# EAGLE schematic DAC (EAGLE 9.5.1)

## Sheet 1 of 6
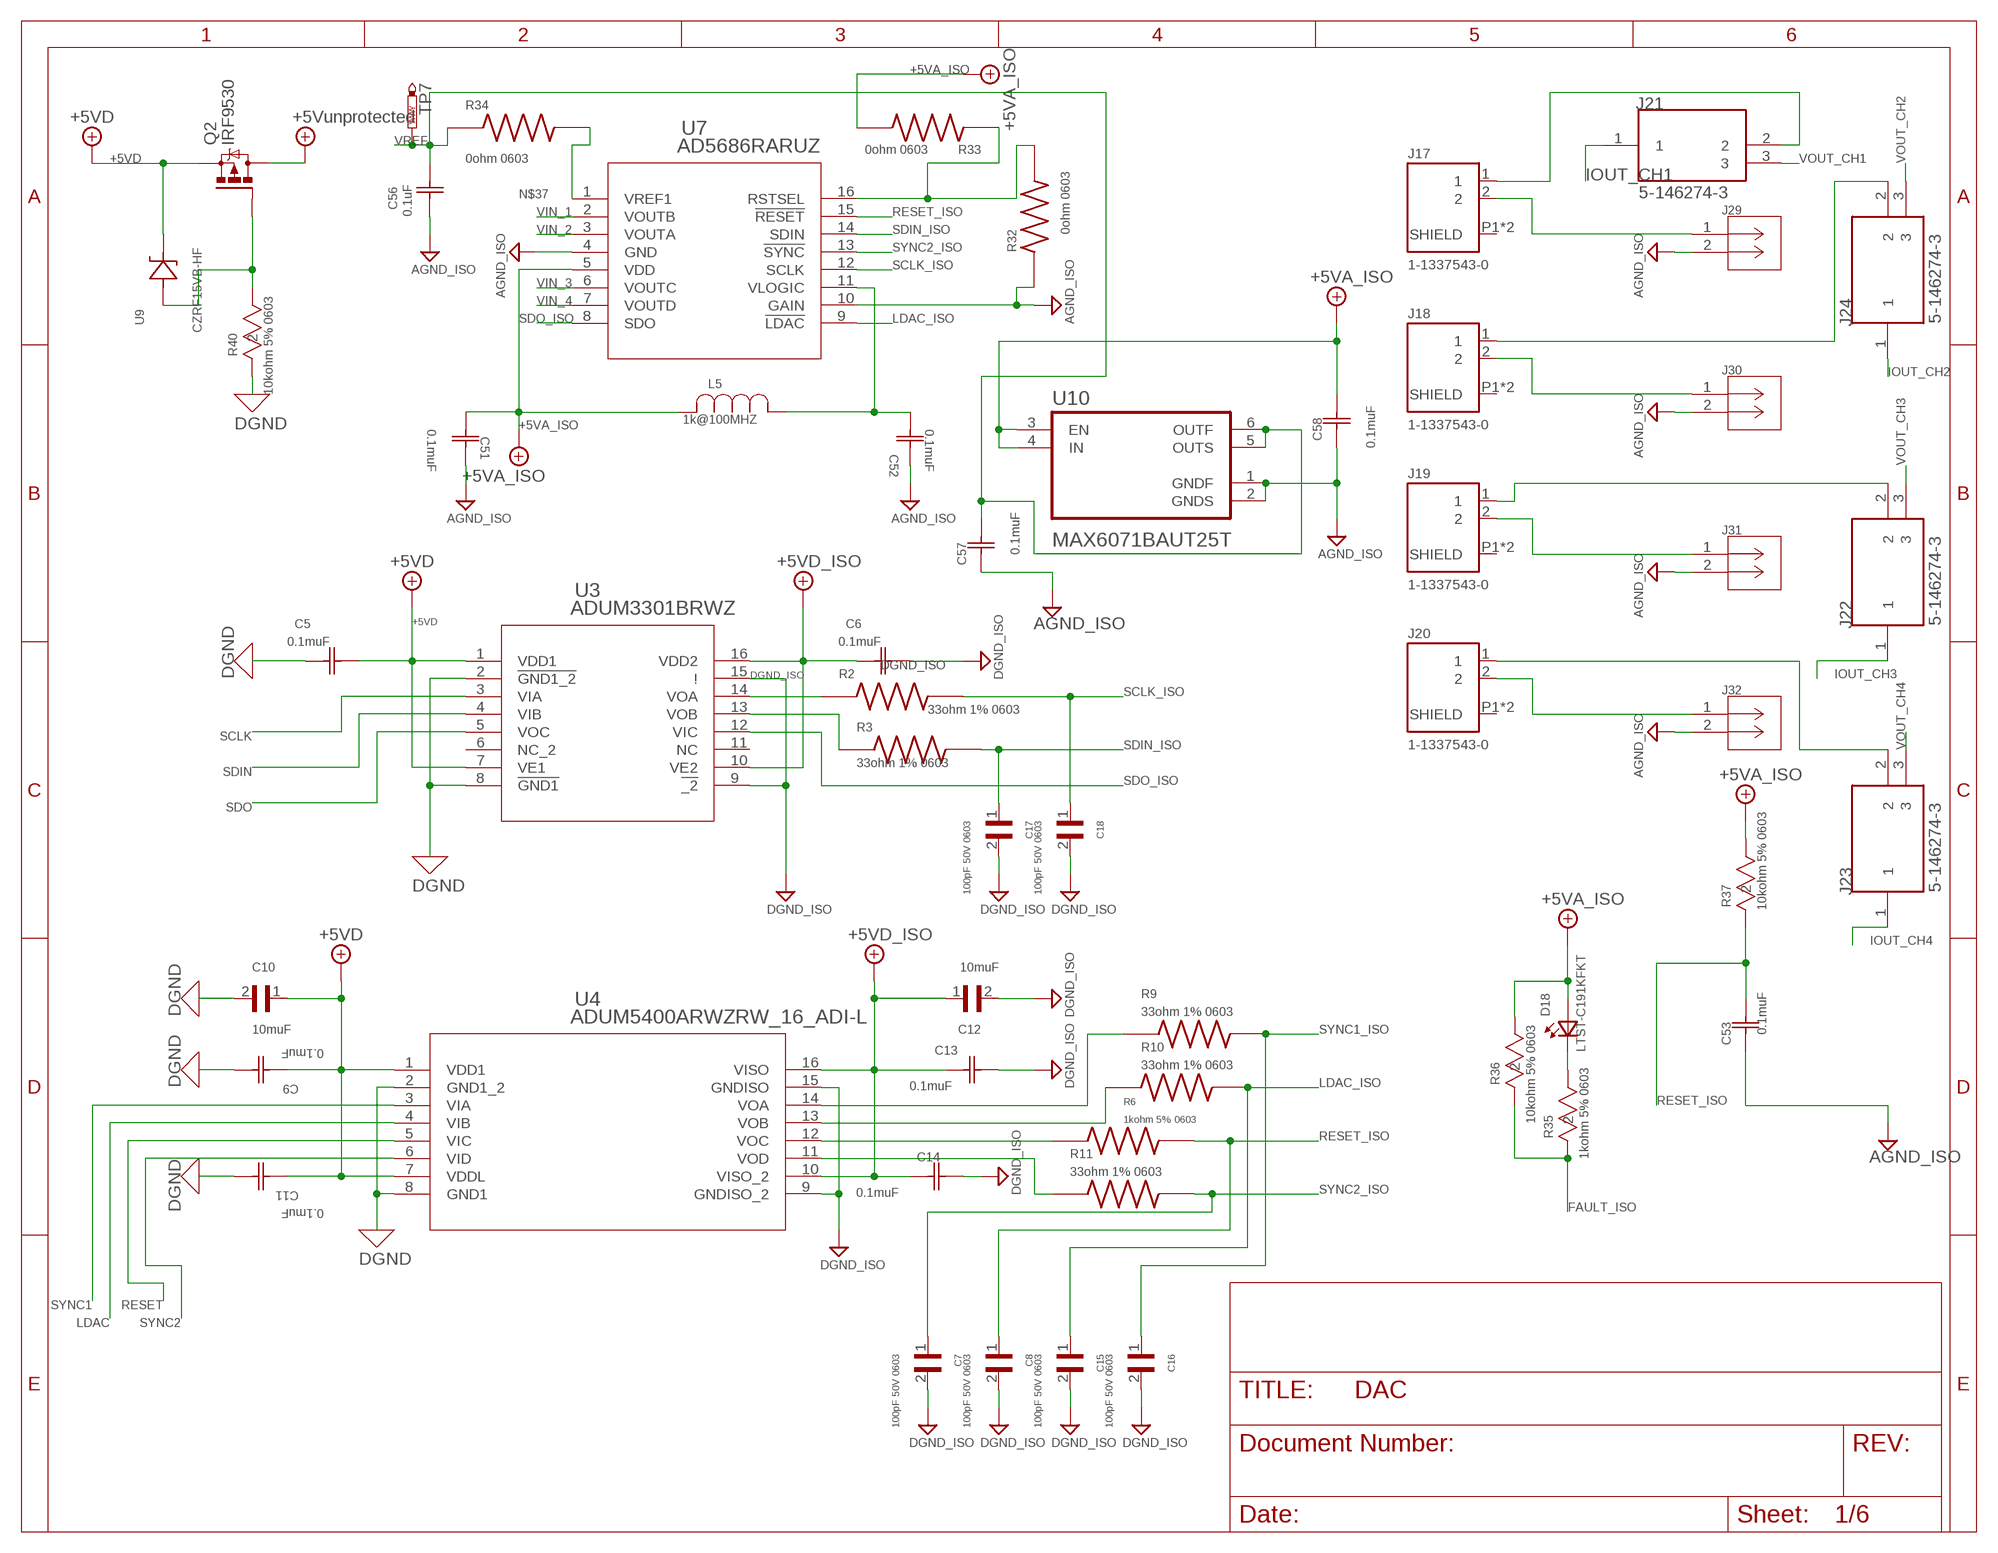
[diagram p0: schematic, sheet 1]

### Parts
C5  0.1muF  GRM188R71E104KA01D  [G-188_MUR]
C6  0.1muF  GRM188R71E104KA01D  [G-188_MUR]
C7  100pF 50V 0603  06035A101JAT2A  [CAPC1608X90N]
C8  100pF 50V 0603  06035A101JAT2A  [CAPC1608X90N]
C9  0.1muF  GRM188R71E104KA01D  [G-188_MUR]
C10  10muF  GRM21BR61A106KE14L  [CAPC2012X135N]
C11  0.1muF  GRM188R71E104KA01D  [G-188_MUR]
C12  10muF  GRM21BR61A106KE14L  [CAPC2012X135N]
C13  0.1muF  GRM188R71E104KA01D  [G-188_MUR]
C14  0.1muF  GRM188R71E104KA01D  [G-188_MUR]
C15  100pF 50V 0603  06035A101JAT2A  [CAPC1608X90N]
C16  100pF 50V 0603  06035A101JAT2A  [CAPC1608X90N]
C17  100pF 50V 0603  06035A101JAT2A  [CAPC1608X90N]
C18  100pF 50V 0603  06035A101JAT2A  [CAPC1608X90N]
C51  0.1muF  GRM188R71E104KA01D  [G-188_MUR]
C52  0.1muF  GRM188R71E104KA01D  [G-188_MUR]
C53  0.1muF  GRM188R71E104KA01D  [G-188_MUR]
C56  0.1muF  GRM188R71E104KA01D  [G-188_MUR]
C57  0.1muF  GRM188R71E104KA01D  [G-188_MUR]
C58  0.1muF  GRM188R71E104KA01D  [G-188_MUR]
D18  LTST-C191KFKT  [0603]
J17  1-1337543-0  [CONN_1-1337543-0]
J18  1-1337543-0  [CONN_1-1337543-0]
J19  1-1337543-0  [CONN_1-1337543-0]
J20  1-1337543-0  [CONN_1-1337543-0]
J21  5-146274-3  [TE_5-146274-3]
J22  5-146274-3  [TE_5-146274-3]
J23  5-146274-3  [TE_5-146274-3]
J24  5-146274-3  [TE_5-146274-3]
J29  61300211121  [CONN_61300211121_WRE]
J30  61300211121  [CONN_61300211121_WRE]
J31  61300211121  [CONN_61300211121_WRE]
J32  61300211121  [CONN_61300211121_WRE]
L5  1k@100MHZ  BLM18AG601SN1D  [IND_BLM18_0603_MUR]
Q2  IRF9530  [TO220BV]
R2  33ohm 1% 0603  CRCW060333R0FKEA  [RESC1508X50N]
R3  33ohm 1% 0603  CRCW060333R0FKEA  [RESC1508X50N]
R6  1kohm 5% 0603  ERJ-3GEYJ102V  [RESC1608X55N]
R9  33ohm 1% 0603  CRCW060333R0FKEA  [RESC1508X50N]
R10  33ohm 1% 0603  CRCW060333R0FKEA  [RESC1508X50N]
R11  33ohm 1% 0603  CRCW060333R0FKEA  [RESC1508X50N]
R32  0ohm 0603  CRCW06030000Z0EBC  [RESC1608X55N]
R33  0ohm 0603  CRCW06030000Z0EBC  [RESC1608X55N]
R34  0ohm 0603  CRCW06030000Z0EBC  [RESC1608X55N]
R35  1kohm 5% 0603  ERA-3AEB153V  [RC0603N_PAN]
R36  10kohm 5% 0603  ERA-3AEB153V  [RC0603N_PAN]
R37  10kohm 5% 0603  ERA-3AEB153V  [RC0603N_PAN]
R40  10kohm 5% 0603  ERA-3AEB153V  [RC0603N_PAN]
TP7  PTR1B1,27  [B1,27]
U3  ADUM3301BRWZ  [RW_16_ADI]
U4  ADUM5400ARWZRW_16_ADI-L  [RW_16_ADI-L]
U7  AD5686RARUZ  [RU-16_ADI]
U9  CZRF15VB-HF  [CZRF]
U10  MAX6071BAUT25T  [SOT95P280X145-6N]

### Nets
+5V_UN: Q2.D ; supply symbol labelled +5Vunprotected
+5VA_ISO: C51.1 C58.2 D18.2(A2) L5.2 R33.2 R36.1 R37.1 U7.5(VDD) U10.3(EN) U10.4(IN) ; also sheet 2,3,4,5
+5VD: C5.2 C9.1 C10.1 C11.1 Q2.S U3.1(VDD1) U3.7(VE1) U4.1(VDD1) U4.7(VDDL) U9.1 ; also sheet 2
+5VD_ISO: C6.1 C12.1 C13.1 C14.1 U3.10(VE2) U3.16(VDD2) U4.10(VISO_2) U4.16(VISO) ; also sheet 3
AGND_ISO: C51.2 C52.2 C53.1 C56.1 C57.1 C58.1 J29.2 J30.2 J31.2 J32.2 R32.1 U7.4(GND) U7.10(GAIN) U10.1(GNDF) U10.2(GNDS) ; also sheet 2,3,4,5
DGND: C5.1 C9.2 C10.2 C11.2 R40.2 U3.2(!GND1_2) U3.8(!GND1) U4.2(GND1_2) U4.8(GND1) ; also sheet 2
DGND_ISO: C6.2 C7.2 C8.2 C12.2 C13.2 C14.2 C15.2 C16.2 C17.2 C18.2 U3.9(!_2) U3.15(!) U4.9(GNDISO_2) U4.15(GNDISO) ; also sheet 3
FAULT_ISO: R35.2 R36.2 ; also sheet 2,3,4,5
IOUT_CH1: J21.1 ; also sheet 3
IOUT_CH2: J24.1 ; also sheet 4
IOUT_CH3: J22.1 ; also sheet 5
IOUT_CH4: J23.1 ; also sheet 2
LDAC: U4.4(VIB) ; also sheet 2
LDAC_ISO: C15.1 R10.2 U7.9(!LDAC)
N$5: C52.1 L5.1 U7.11(VLOGIC)
N$7: R9.1 U4.14(VOA)
N$8: R2.1 U3.14(VOA)
N$9: R3.1 U3.13(VOB)
N$10: R10.1 U4.13(VOB)
N$11: R6.1 U4.12(VOC)
N$12: R11.1 U4.11(VOD)
N$31: J17.2 J29.1
N$35: D18.1(K2) R35.1
N$36: J18.2 J30.1
N$37: R34.2 U7.1(VREF1)
N$38: J17.1 J21.2
N$41: J18.1 J24.2
N$43: J19.2 J31.1
N$44: J19.1 J22.2
N$45: J20.1 J23.2
N$55: J20.2 J32.1
N$80: Q2.G R40.1 U9.2
N$89: R32.2 R33.1 U7.16(RSTSEL)
RESET: U4.5(VIC) ; also sheet 2
RESET_ISO: C8.1 C53.2 R6.2 R37.2 U7.15(!RESET) ; also sheet 2,3,4,5
SCLK: U3.3(VIA) ; also sheet 2
SCLK_ISO: C18.1 R2.2 U7.12(SCLK) ; also sheet 2,3,4,5
SDIN: U3.4(VIB) ; also sheet 2
SDIN_ISO: C17.1 R3.2 U7.14(SDIN) ; also sheet 2,3,4,5
SDO: U3.5(VOC) ; also sheet 2
SDO_ISO: U3.12(VIC) U7.8(SDO) ; also sheet 2,3,4,5
SYNC1: U4.3(VIA) ; also sheet 2
SYNC1_ISO: C16.1 R9.2 ; also sheet 2,3,4,5
SYNC2: U4.6(VID) ; also sheet 2
SYNC2_ISO: C7.1 R11.2 U7.13(!SYNC)
VIN_1: U7.2(VOUTB) ; also sheet 3
VIN_2: U7.3(VOUTA) ; also sheet 4
VIN_3: U7.6(VOUTC) ; also sheet 5
VIN_4: U7.7(VOUTD) ; also sheet 2
VOUT_CH1: J21.3 ; also sheet 3
VOUT_CH2: J24.3 ; also sheet 4
VOUT_CH3: J22.3 ; also sheet 5
VOUT_CH4: J23.3 ; also sheet 2
VREF: C56.2 C57.2 R34.1 TP7.TP U10.5(OUTS) U10.6(OUTF) ; also sheet 2,3,4,5
Unconnected: J17.P1(SHIELD) J17.P2(SHIELD) J18.P1(SHIELD) J18.P2(SHIELD) J19.P1(SHIELD) J19.P2(SHIELD) J20.P1(SHIELD) J20.P2(SHIELD) U3.6(NC_2) U3.11(NC)

### Notes on the sheet
- 0.1uF

## Sheet 2 of 6
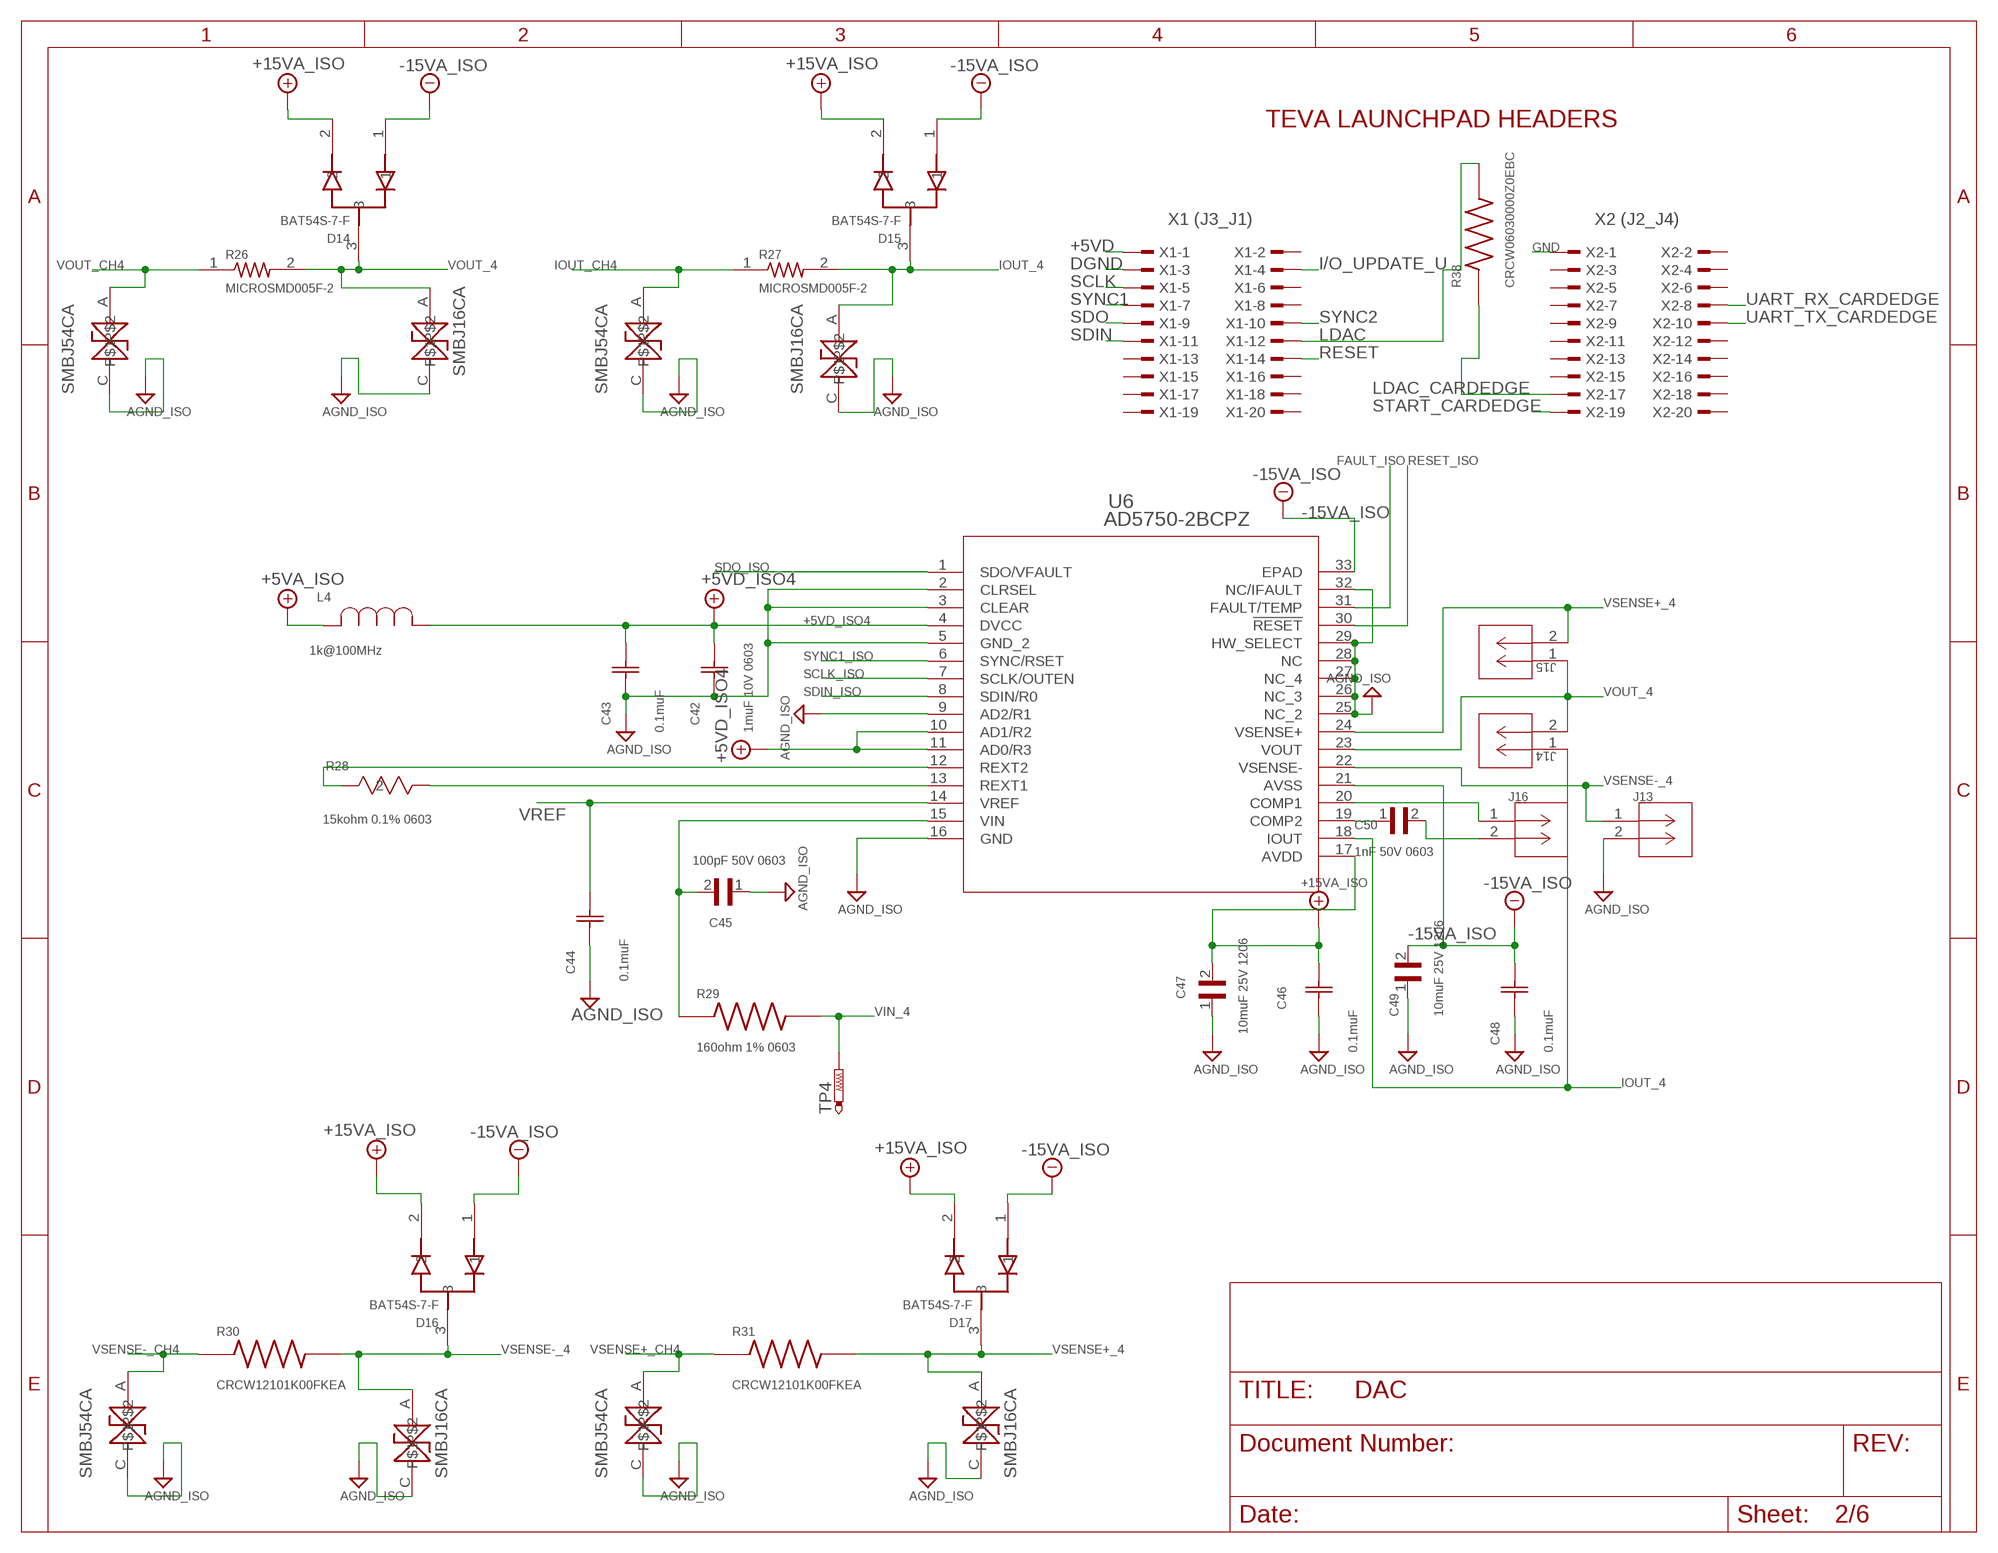
[diagram p1: schematic, sheet 2]

### Parts
C42  1muF 10V 0603  C0603C105K4PALTU  [CAPC17595_90N_KEM]
C43  0.1muF  GRM188R71E104KA01D  [G-188_MUR]
C44  0.1muF  GRM188R71E104KA01D  [G-188_MUR]
C45  100pF 50V 0603  06035A101JAT2A  [CAPC1608X90N]
C46  0.1muF  GRM188R71E104KA01D  [G-188_MUR]
C47  10muF 25V 1206  C1206C106Z3VAC7800  [CAPC3216X180N]
C48  0.1muF  GRM188R71E104KA01D  [G-188_MUR]
C49  10muF 25V 1206  C1206C106Z3VAC7800  [CAPC3216X180N]
C50  1nF 50V 0603  GRM1885C1H102JA01D  [CAPC1608X90N]
D14  BAT54S-7-F  [SOT95P240X110-3N]
D15  BAT54S-7-F  [SOT95P240X110-3N]
D16  BAT54S-7-F  [SOT95P240X110-3N]
D17  BAT54S-7-F  [SOT95P240X110-3N]
J13  61300211121  [CONN_61300211121_WRE]
J14  61300211121  [CONN_61300211121_WRE]
J15  61300211121  [CONN_61300211121_WRE]
J16  61300211121  [CONN_61300211121_WRE]
L4  1k@100MHz  BLM18AG601SN1D  [IND_BLM18_0603_MUR]
R26  MICROSMD005F-2  [RESC3125X65N]
R27  MICROSMD005F-2  [RESC3125X65N]
R28  15kohm 0.1% 0603  ERA-3AEB153V  [RC0603N_PAN]
R29  160ohm 1% 0603  ERJ-3GEYJ102V  [RESC1608X55N]
R30  CRCW12101K00FKEA  [RESC3225X60N]
R31  CRCW12101K00FKEA  [RESC3225X60N]
R38  CRCW06030000Z0EBC  [RESC1608X55N]
TP4  PTR1B1,27  [B1,27]
TV1  54_SMBJ54CA  [DIOM5436X220N]
TV2  54_SMBJ54CA  [DIOM5436X220N]
TV3  SMBJ54CA  54_SMBJ54CA  [DIOM5436X220N]
TV4  54_SMBJ54CA  [DIOM5436X220N]
TV17  SMBJ16CA  [DIOM5436X220N]
TV18  SMBJ16CA  [DIOM5436X220N]
TV19  SMBJ16CA  [DIOM5436X220N]
TV20  SMBJ16CA  [DIOM5436X220N]
U6  AD5750-2BCPZ  [CP_32_7_ADI]
X1  X1 (J3_J1)  TSW-110-07-G-D  [TSW-110-XX-G-D]
X2  X2 (J2_J4)  TSW-110-07-G-D  [TSW-110-XX-G-D]

### Nets
+5VA_ISO: L4.2 ; also sheet 1,3,4,5
+5VD: X1.1 ; also sheet 1
+5VD_ISO4: C42.2 C43.2 L4.1 U6.4(DVCC) U6.10(AD1/R2) U6.11(AD0/R3)
+15VA_ISO: C46.2 C47.2 D14.2 D15.2 D16.2 D17.2 U6.17(AVDD) ; also sheet 3,4,5
-15VA_ISO: C48.2 C49.2 D14.1 D15.1 D16.1 D17.1 U6.21(AVSS) U6.33(EPAD) ; also sheet 3,4,5
AGND_ISO: C42.1 C43.1 C44.1 C45.1 C46.1 C47.1 C48.1 C49.1 J13.2 TV1.C TV2.C TV3.C TV4.C TV17.C TV18.C TV19.C TV20.C U6.2(CLRSEL) U6.3(CLEAR) U6.5(GND_2) U6.9(AD2/R1) U6.16(GND) U6.25(NC_2) U6.26(NC_3) U6.27(NC_4) U6.28(NC) U6.29(HW_SELECT) U6.32(NC/IFAULT) ; also sheet 1,3,4,5
DGND: X1.3 ; also sheet 1
FAULT_ISO: U6.31(FAULT/TEMP) ; also sheet 1,3,4,5
GND: X2.1
I/O_UPDATE_U: X1.4
IOUT_4: D15.3 J14.1 R27.2 TV18.A U6.18(IOUT)
IOUT_CH4: R27.1 TV2.A ; also sheet 1
LDAC: R38.2 X1.12 ; also sheet 1
LDAC_CARDEDGE: R38.1 X2.17
N$4: R28.2 U6.12(REXT2)
N$22: R28.1 U6.13(REXT1)
N$27: C45.2 R29.1 U6.15(VIN)
N$28: C50.1 U6.19(COMP2)
N$29: J16.1 U6.20(COMP1)
N$30: C50.2 J16.2
RESET: X1.14 ; also sheet 1
RESET_ISO: U6.30(!RESET) ; also sheet 1,3,4,5
SCLK: X1.5 ; also sheet 1
SCLK_ISO: U6.7(SCLK/OUTEN) ; also sheet 1,3,4,5
SDIN: X1.11 ; also sheet 1
SDIN_ISO: U6.8(SDIN/R0) ; also sheet 1,3,4,5
SDO: X1.9 ; also sheet 1
SDO_ISO: U6.1(SDO/VFAULT) ; also sheet 1,3,4,5
START_CARDEDGE: X2.19
SYNC1: X1.7 ; also sheet 1
SYNC1_ISO: U6.6(SYNC/RSET) ; also sheet 1,3,4,5
SYNC2: X1.10 ; also sheet 1
UART_RX_CARDEDGE: X2.8
UART_TX_CARDEDGE: X2.10
VIN_4: R29.2 TP4.TP ; also sheet 1
VOUT_4: D14.3 J14.2 J15.1 R26.2 TV17.A U6.23(VOUT)
VOUT_CH4: R26.1 TV1.A ; also sheet 1
VREF: C44.2 U6.14(VREF) ; also sheet 1,3,4,5
VSENSE+_4: D17.3 J15.2 R31.2 TV20.A U6.24(VSENSE+)
VSENSE+_CH4: R31.1 TV4.A
VSENSE-_4: D16.3 J13.1 R30.2 TV19.A U6.22(VSENSE-)
VSENSE-_CH4: R30.1 TV3.A
Unconnected: X1.2 X1.6 X1.8 X1.13 X1.15 X1.16 X1.17 X1.18 X1.19 X1.20 X2.2 X2.3 X2.4 X2.5 X2.6 X2.7 X2.9 X2.11 X2.12 X2.13 X2.14 X2.15 X2.16 X2.18 X2.20

### Notes on the sheet
- TEVA LAUNCHPAD HEADERS
- SMBJ16CA
- SMBJ54CA | SMBJ54CA | SMBJ16CA
- SMBJ54CA | SMBJ16CA | SMBJ54CA | SMBJ16CA

## Sheet 3 of 6
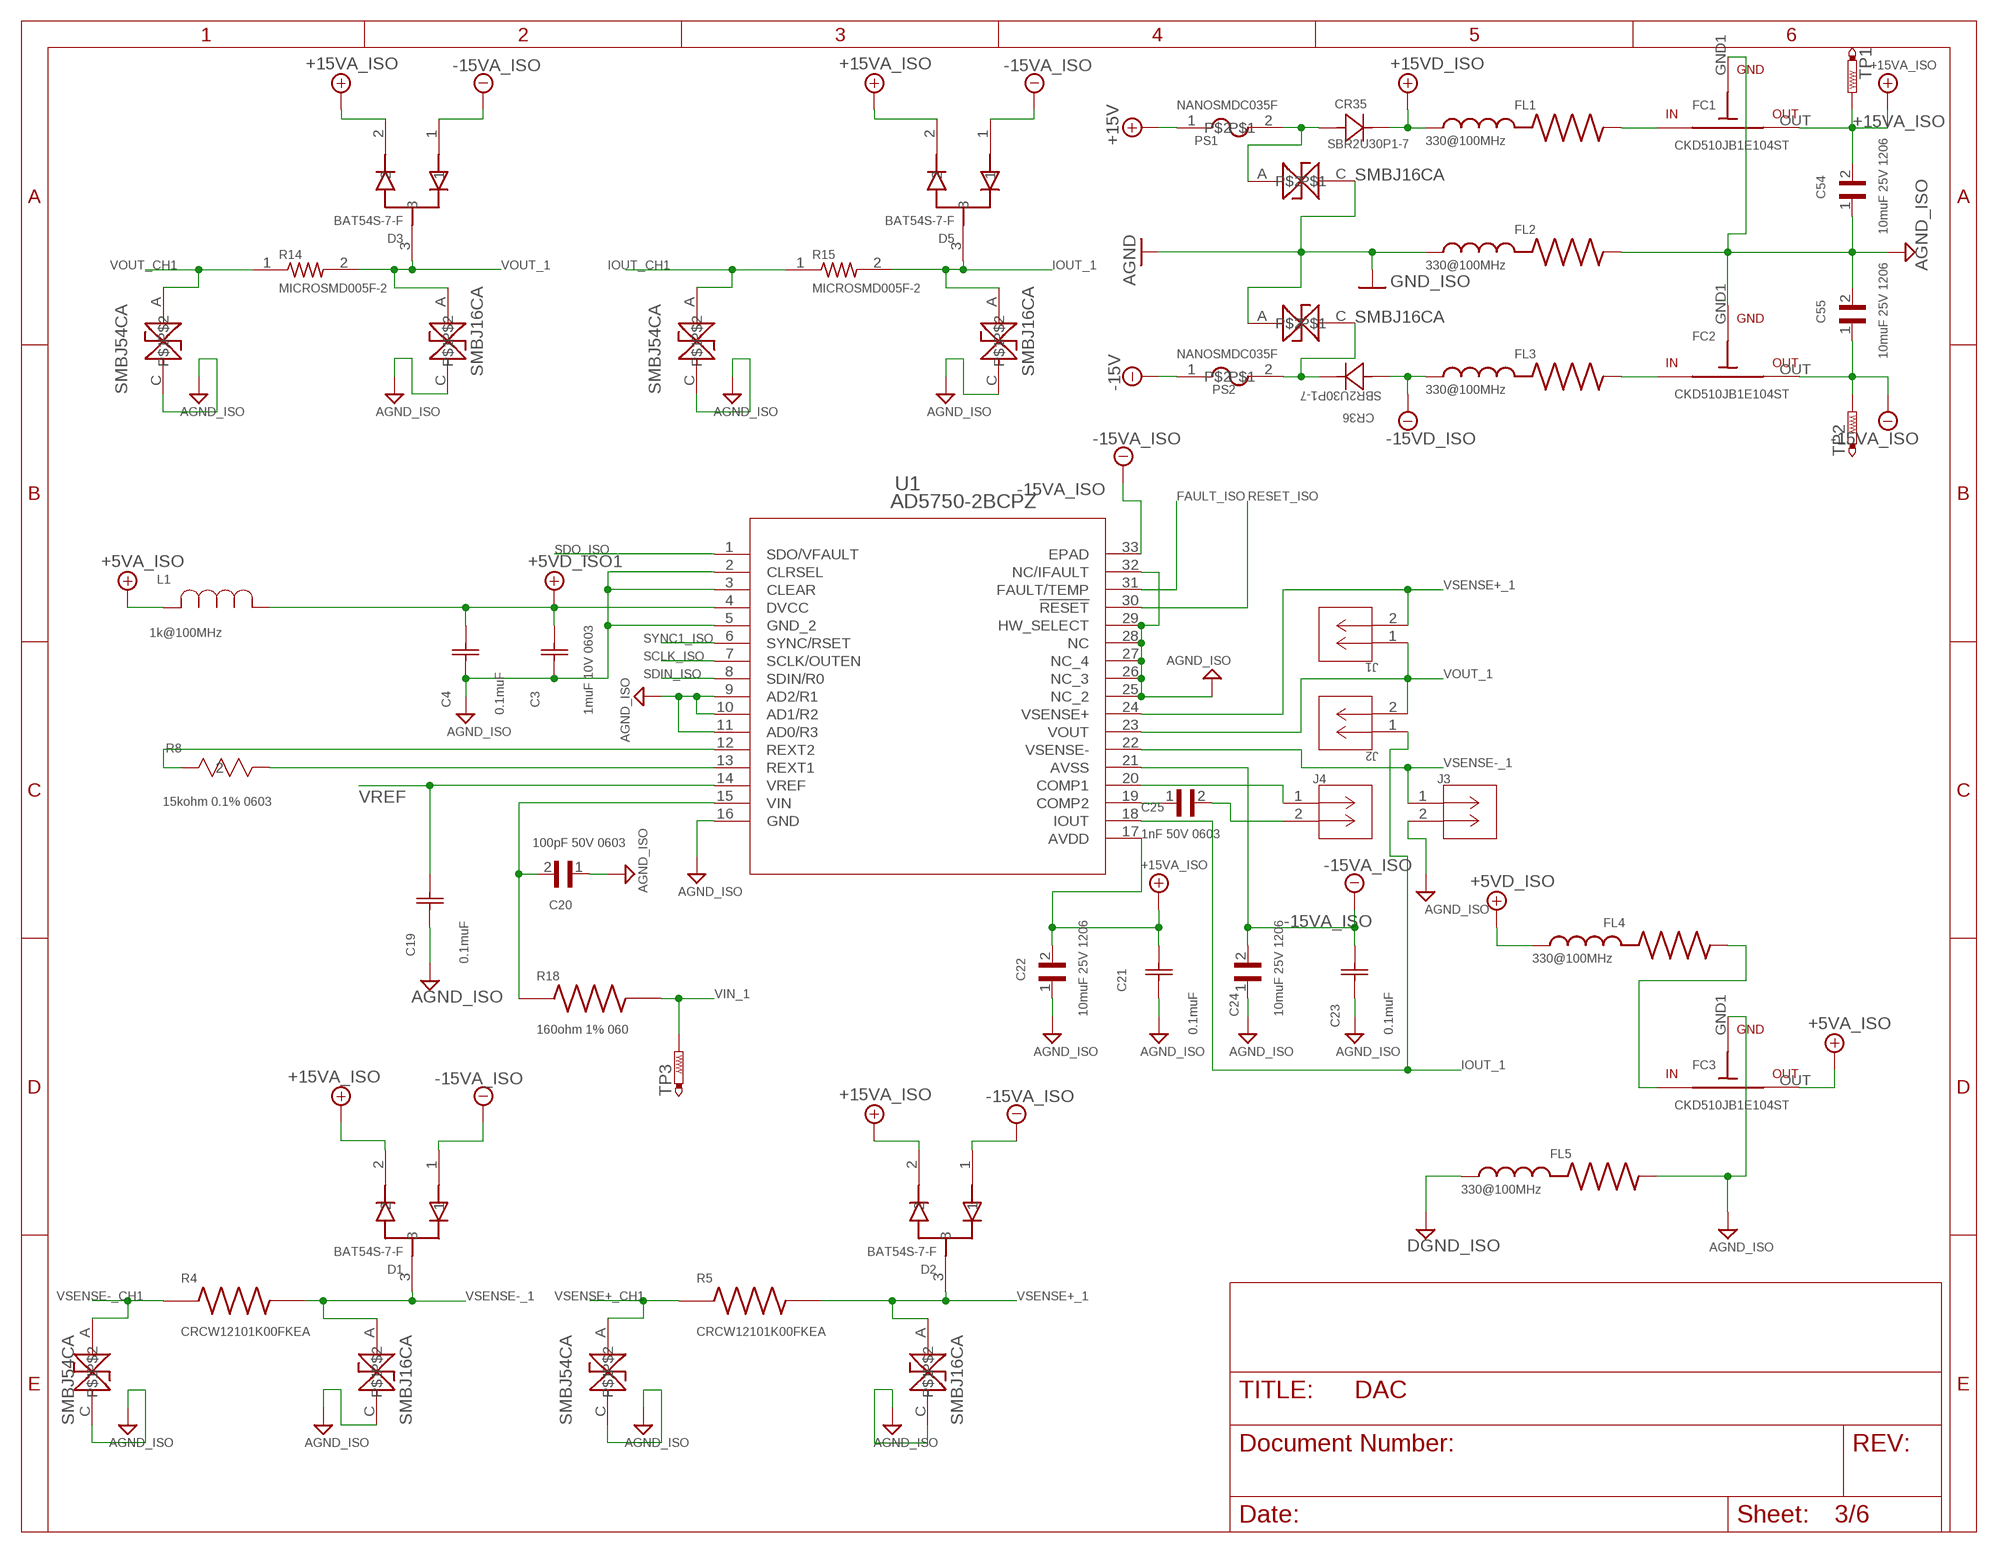
[diagram p2: schematic, sheet 3]

### Parts
C3  1muF 10V 0603  C0603C105K4PALTU  [CAPC17595_90N_KEM]
C4  0.1muF  GRM188R71E104KA01D  [G-188_MUR]
C19  0.1muF  GRM188R71E104KA01D  [G-188_MUR]
C20  100pF 50V 0603  06035A101JAT2A  [CAPC1608X90N]
C21  0.1muF  GRM188R71E104KA01D  [G-188_MUR]
C22  10muF 25V 1206  C1206C106Z3VAC7800  [CAPC3216X180N]
C23  0.1muF  GRM188R71E104KA01D  [G-188_MUR]
C24  10muF 25V 1206  C1206C106Z3VAC7800  [CAPC3216X180N]
C25  1nF 50V 0603  GRM1885C1H102JA01D  [CAPC1608X90N]
C54  10muF 25V 1206  C1206C106Z3VAC7800  [CAPC3216X180N]
C55  10muF 25V 1206  C1206C106Z3VAC7800  [CAPC3216X180N]
CR35  SBR2U30P1-7  [DIODE_SBR3M30P1_1P78X2P8_DIO]
CR36  SBR2U30P1-7  [DIODE_SBR3M30P1_1P78X2P8_DIO]
D1  BAT54S-7-F  [SOT95P240X110-3N]
D2  BAT54S-7-F  [SOT95P240X110-3N]
D3  BAT54S-7-F  [SOT95P240X110-3N]
D5  BAT54S-7-F  [SOT95P240X110-3N]
FC1  F1-4  [FCAP]
FC2  F1-4  [FCAP]
FC3  F1-4  [FCAP]
FL1  330@100MHz  BLM21PG331SN1D  [BEADC2012X105N]
FL2  330@100MHz  BLM21PG331SN1D  [BEADC2012X105N]
FL3  330@100MHz  BLM21PG331SN1D  [BEADC2012X105N]
FL4  330@100MHz  BLM21PG331SN1D  [BEADC2012X105N]
FL5  330@100MHz  BLM21PG331SN1D  [BEADC2012X105N]
J1  61300211121  [CONN_61300211121_WRE]
J2  61300211121  [CONN_61300211121_WRE]
J3  61300211121  [CONN_61300211121_WRE]
J4  61300211121  [CONN_61300211121_WRE]
L1  1k@100MHz  BLM18AG601SN1D  [IND_BLM18_0603_MUR]
PS1  POLYSWITCH  [RESC3115X65N]
PS2  POLYSWITCH  [RESC3115X65N]
R4  CRCW12101K00FKEA  [RESC3225X60N]
R5  CRCW12101K00FKEA  [RESC3225X60N]
R8  15kohm 0.1% 0603  ERA-3AEB153V  [RC0603N_PAN]
R14  MICROSMD005F-2  [RESC3125X65N]
R15  MICROSMD005F-2  [RESC3125X65N]
R18  160ohm 1% 060  ERJ-3GEYJ102V  [RESC1608X55N]
TP1  PTR1B1,27  [B1,27]
TP2  PTR1B1,27  [B1,27]
TP3  PTR1B1,27  [B1,27]
TV5  54_SMBJ54CA  [DIOM5436X220N]
TV6  54_SMBJ54CA  [DIOM5436X220N]
TV7  54_SMBJ54CA  [DIOM5436X220N]
TV8  54_SMBJ54CA  [DIOM5436X220N]
TV21  SMBJ16CA  [DIOM5436X220N]
TV22  SMBJ16CA  [DIOM5436X220N]
TV23  SMBJ16CA  [DIOM5436X220N]
TV24  SMBJ16CA  [DIOM5436X220N]
TV33  SMBJ16CA  [DIOM5436X220N]
TV34  SMBJ16CA  [DIOM5436X220N]
U1  AD5750-2BCPZ  [CP_32_7_ADI]

### Nets
+5VA_ISO: FC3.OUT L1.2 ; also sheet 1,2,4,5
+5VD_ISO: FL4.1 ; also sheet 1
+5VD_ISO1: C3.2 C4.2 L1.1 U1.4(DVCC)
+15V: PS1.1
+15VA_ISO: C21.2 C22.2 C54.2 D1.2 D2.2 D3.2 D5.2 FC1.OUT TP1.TP U1.17(AVDD) ; also sheet 2,4,5
+15VD_ISO: CR35.1 FL1.1
-15V: PS2.1
-15VA_ISO: C23.2 C24.2 C55.1 D1.1 D2.1 D3.1 D5.1 FC2.OUT TP2.TP U1.21(AVSS) U1.33(EPAD) ; also sheet 2,4,5
-15VD_ISO: CR36.2 FL3.1
AGND: FL2.1 TV33.C TV34.A ; supply symbol labelled GND_ISO
AGND_ISO: C3.1 C4.1 C19.1 C20.1 C21.1 C22.1 C23.1 C24.1 C54.1 C55.2 FC1.GND1 FC2.GND1 FC3.GND1 FL2.2 FL5.2 J3.2 TV5.C TV6.C TV7.C TV8.C TV21.C TV22.C TV23.C TV24.C U1.2(CLRSEL) U1.3(CLEAR) U1.5(GND_2) U1.9(AD2/R1) U1.10(AD1/R2) U1.11(AD0/R3) U1.16(GND) U1.25(NC_2) U1.26(NC_3) U1.27(NC_4) U1.28(NC) U1.29(HW_SELECT) U1.32(NC/IFAULT) ; also sheet 1,2,4,5
DGND_ISO: FL5.1 ; also sheet 1
FAULT_ISO: U1.31(FAULT/TEMP) ; also sheet 1,2,4,5
IOUT_1: D5.3 J2.1 R15.2 TV22.A U1.18(IOUT)
IOUT_CH1: R15.1 TV6.A ; also sheet 1
N$2: C20.2 R18.1 U1.15(VIN)
N$13: C25.1 U1.19(COMP2)
N$14: J4.1 U1.20(COMP1)
N$15: C25.2 J4.2
N$32: R8.2 U1.12(REXT2)
N$33: R8.1 U1.13(REXT1)
N$39: FC3.IN FL4.2
N$40: CR35.2 PS1.2 TV33.A
N$42: FC1.IN FL1.2
N$47: CR36.1 PS2.2 TV34.C
N$49: FC2.IN FL3.2
RESET_ISO: U1.30(!RESET) ; also sheet 1,2,4,5
SCLK_ISO: U1.7(SCLK/OUTEN) ; also sheet 1,2,4,5
SDIN_ISO: U1.8(SDIN/R0) ; also sheet 1,2,4,5
SDO_ISO: U1.1(SDO/VFAULT) ; also sheet 1,2,4,5
SYNC1_ISO: U1.6(SYNC/RSET) ; also sheet 1,2,4,5
VIN_1: R18.2 TP3.TP ; also sheet 1
VOUT_1: D3.3 J1.1 J2.2 R14.2 TV21.A U1.23(VOUT)
VOUT_CH1: R14.1 TV5.A ; also sheet 1
VREF: C19.2 U1.14(VREF) ; also sheet 1,2,4,5
VSENSE+_1: D2.3 J1.2 R5.2 TV24.A U1.24(VSENSE+)
VSENSE+_CH1: R5.1 TV8.A
VSENSE-_1: D1.3 J3.1 R4.2 TV23.A U1.22(VSENSE-)
VSENSE-_CH1: R4.1 TV7.A

### Notes on the sheet
- NANOSMDC035F | FC1
- PS1
- CKD510JB1E104ST
- SMBJ16CA
- SMBJ16CA
- FC2
- NANOSMDC035F
- SMBJ16CA | SMBJ16CA
- SMBJ54CA | SMBJ54CA | PS2
- CKD510JB1E104ST
- FC3
- CKD510JB1E104ST
- SMBJ54CA | SMBJ16CA | SMBJ54CA | SMBJ16CA

## Sheet 4 of 6
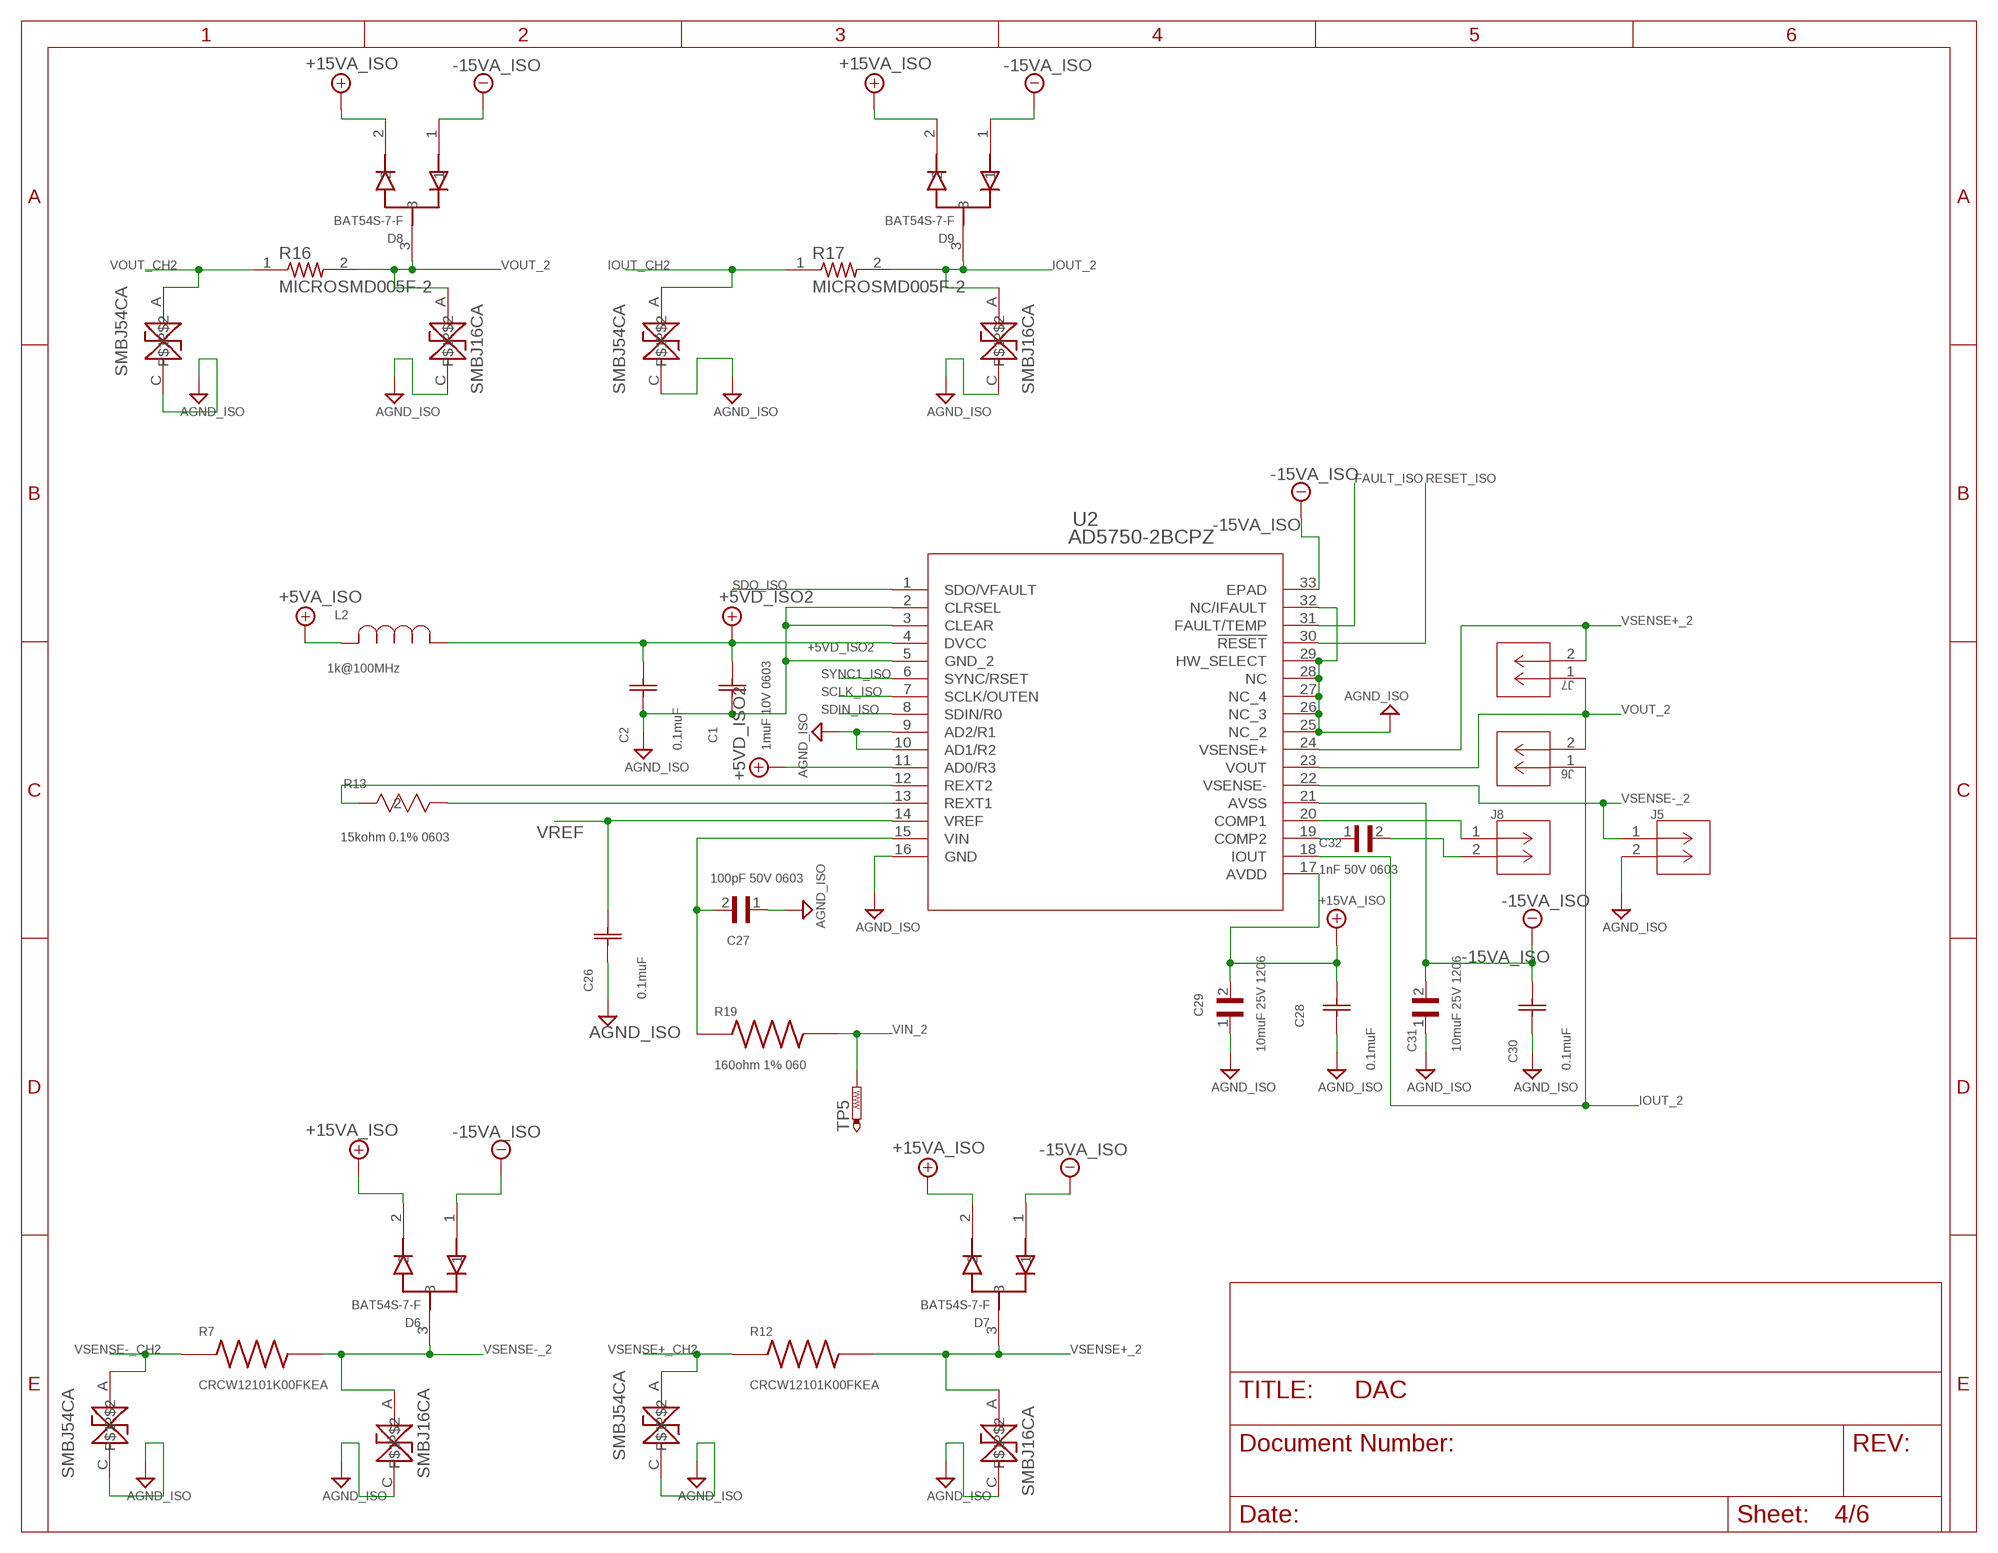
[diagram p3: schematic, sheet 4]

### Parts
C1  1muF 10V 0603  C0603C105K4PALTU  [CAPC17595_90N_KEM]
C2  0.1muF  GRM188R71E104KA01D  [G-188_MUR]
C26  0.1muF  GRM188R71E104KA01D  [G-188_MUR]
C27  100pF 50V 0603  06035A101JAT2A  [CAPC1608X90N]
C28  0.1muF  GRM188R71E104KA01D  [G-188_MUR]
C29  10muF 25V 1206  C1206C106Z3VAC7800  [CAPC3216X180N]
C30  0.1muF  GRM188R71E104KA01D  [G-188_MUR]
C31  10muF 25V 1206  C1206C106Z3VAC7800  [CAPC3216X180N]
C32  1nF 50V 0603  GRM1885C1H102JA01D  [CAPC1608X90N]
D6  BAT54S-7-F  [SOT95P240X110-3N]
D7  BAT54S-7-F  [SOT95P240X110-3N]
D8  BAT54S-7-F  [SOT95P240X110-3N]
D9  BAT54S-7-F  [SOT95P240X110-3N]
J5  61300211121  [CONN_61300211121_WRE]
J6  61300211121  [CONN_61300211121_WRE]
J7  61300211121  [CONN_61300211121_WRE]
J8  61300211121  [CONN_61300211121_WRE]
L2  1k@100MHz  BLM18AG601SN1D  [IND_BLM18_0603_MUR]
R7  CRCW12101K00FKEA  [RESC3225X60N]
R12  CRCW12101K00FKEA  [RESC3225X60N]
R13  15kohm 0.1% 0603  ERA-3AEB153V  [RC0603N_PAN]
R16  MICROSMD005F-2  [RESC3125X65N]
R17  MICROSMD005F-2  [RESC3125X65N]
R19  160ohm 1% 060  ERJ-3GEYJ102V  [RESC1608X55N]
TP5  PTR1B1,27  [B1,27]
TV9  54_SMBJ54CA  [DIOM5436X220N]
TV10  54_SMBJ54CA  [DIOM5436X220N]
TV11  54_SMBJ54CA  [DIOM5436X220N]
TV12  54_SMBJ54CA  [DIOM5436X220N]
TV25  SMBJ16CA  [DIOM5436X220N]
TV26  SMBJ16CA  [DIOM5436X220N]
TV27  SMBJ16CA  [DIOM5436X220N]
TV28  SMBJ16CA  [DIOM5436X220N]
U2  AD5750-2BCPZ  [CP_32_7_ADI]

### Nets
+5VA_ISO: L2.2 ; also sheet 1,2,3,5
+5VD_ISO2: C1.2 C2.2 L2.1 U2.4(DVCC) U2.11(AD0/R3)
+15VA_ISO: C28.2 C29.2 D6.2 D7.2 D8.2 D9.2 U2.17(AVDD) ; also sheet 2,3,5
-15VA_ISO: C30.2 C31.2 D6.1 D7.1 D8.1 D9.1 U2.21(AVSS) U2.33(EPAD) ; also sheet 2,3,5
AGND_ISO: C1.1 C2.1 C26.1 C27.1 C28.1 C29.1 C30.1 C31.1 J5.2 TV9.C TV10.C TV11.C TV12.C TV25.C TV26.C TV27.C TV28.C U2.2(CLRSEL) U2.3(CLEAR) U2.5(GND_2) U2.9(AD2/R1) U2.10(AD1/R2) U2.16(GND) U2.25(NC_2) U2.26(NC_3) U2.27(NC_4) U2.28(NC) U2.29(HW_SELECT) U2.32(NC/IFAULT) ; also sheet 1,2,3,5
FAULT_ISO: U2.31(FAULT/TEMP) ; also sheet 1,2,3,5
IOUT_2: D9.3 J6.1 R17.2 TV26.A U2.18(IOUT)
IOUT_CH2: R17.1 TV10.A ; also sheet 1
N$1: R13.2 U2.12(REXT2)
N$3: R13.1 U2.13(REXT1)
N$16: C27.2 R19.1 U2.15(VIN)
N$17: C32.1 U2.19(COMP2)
N$18: J8.1 U2.20(COMP1)
N$19: C32.2 J8.2
RESET_ISO: U2.30(!RESET) ; also sheet 1,2,3,5
SCLK_ISO: U2.7(SCLK/OUTEN) ; also sheet 1,2,3,5
SDIN_ISO: U2.8(SDIN/R0) ; also sheet 1,2,3,5
SDO_ISO: U2.1(SDO/VFAULT) ; also sheet 1,2,3,5
SYNC1_ISO: U2.6(SYNC/RSET) ; also sheet 1,2,3,5
VIN_2: R19.2 TP5.TP ; also sheet 1
VOUT_2: D8.3 J6.2 J7.1 R16.2 TV25.A U2.23(VOUT)
VOUT_CH2: R16.1 TV9.A ; also sheet 1
VREF: C26.2 U2.14(VREF) ; also sheet 1,2,3,5
VSENSE+_2: D7.3 J7.2 R12.2 TV28.A U2.24(VSENSE+)
VSENSE+_CH2: R12.1 TV12.A
VSENSE-_2: D6.3 J5.1 R7.2 TV27.A U2.22(VSENSE-)
VSENSE-_CH2: R7.1 TV11.A

### Notes on the sheet
- SMBJ54CA
- SMBJ16CA | SMBJ54CA | SMBJ16CA
- SMBJ54CA
- SMBJ54CA | SMBJ16CA
- SMBJ16CA

## Sheet 5 of 6
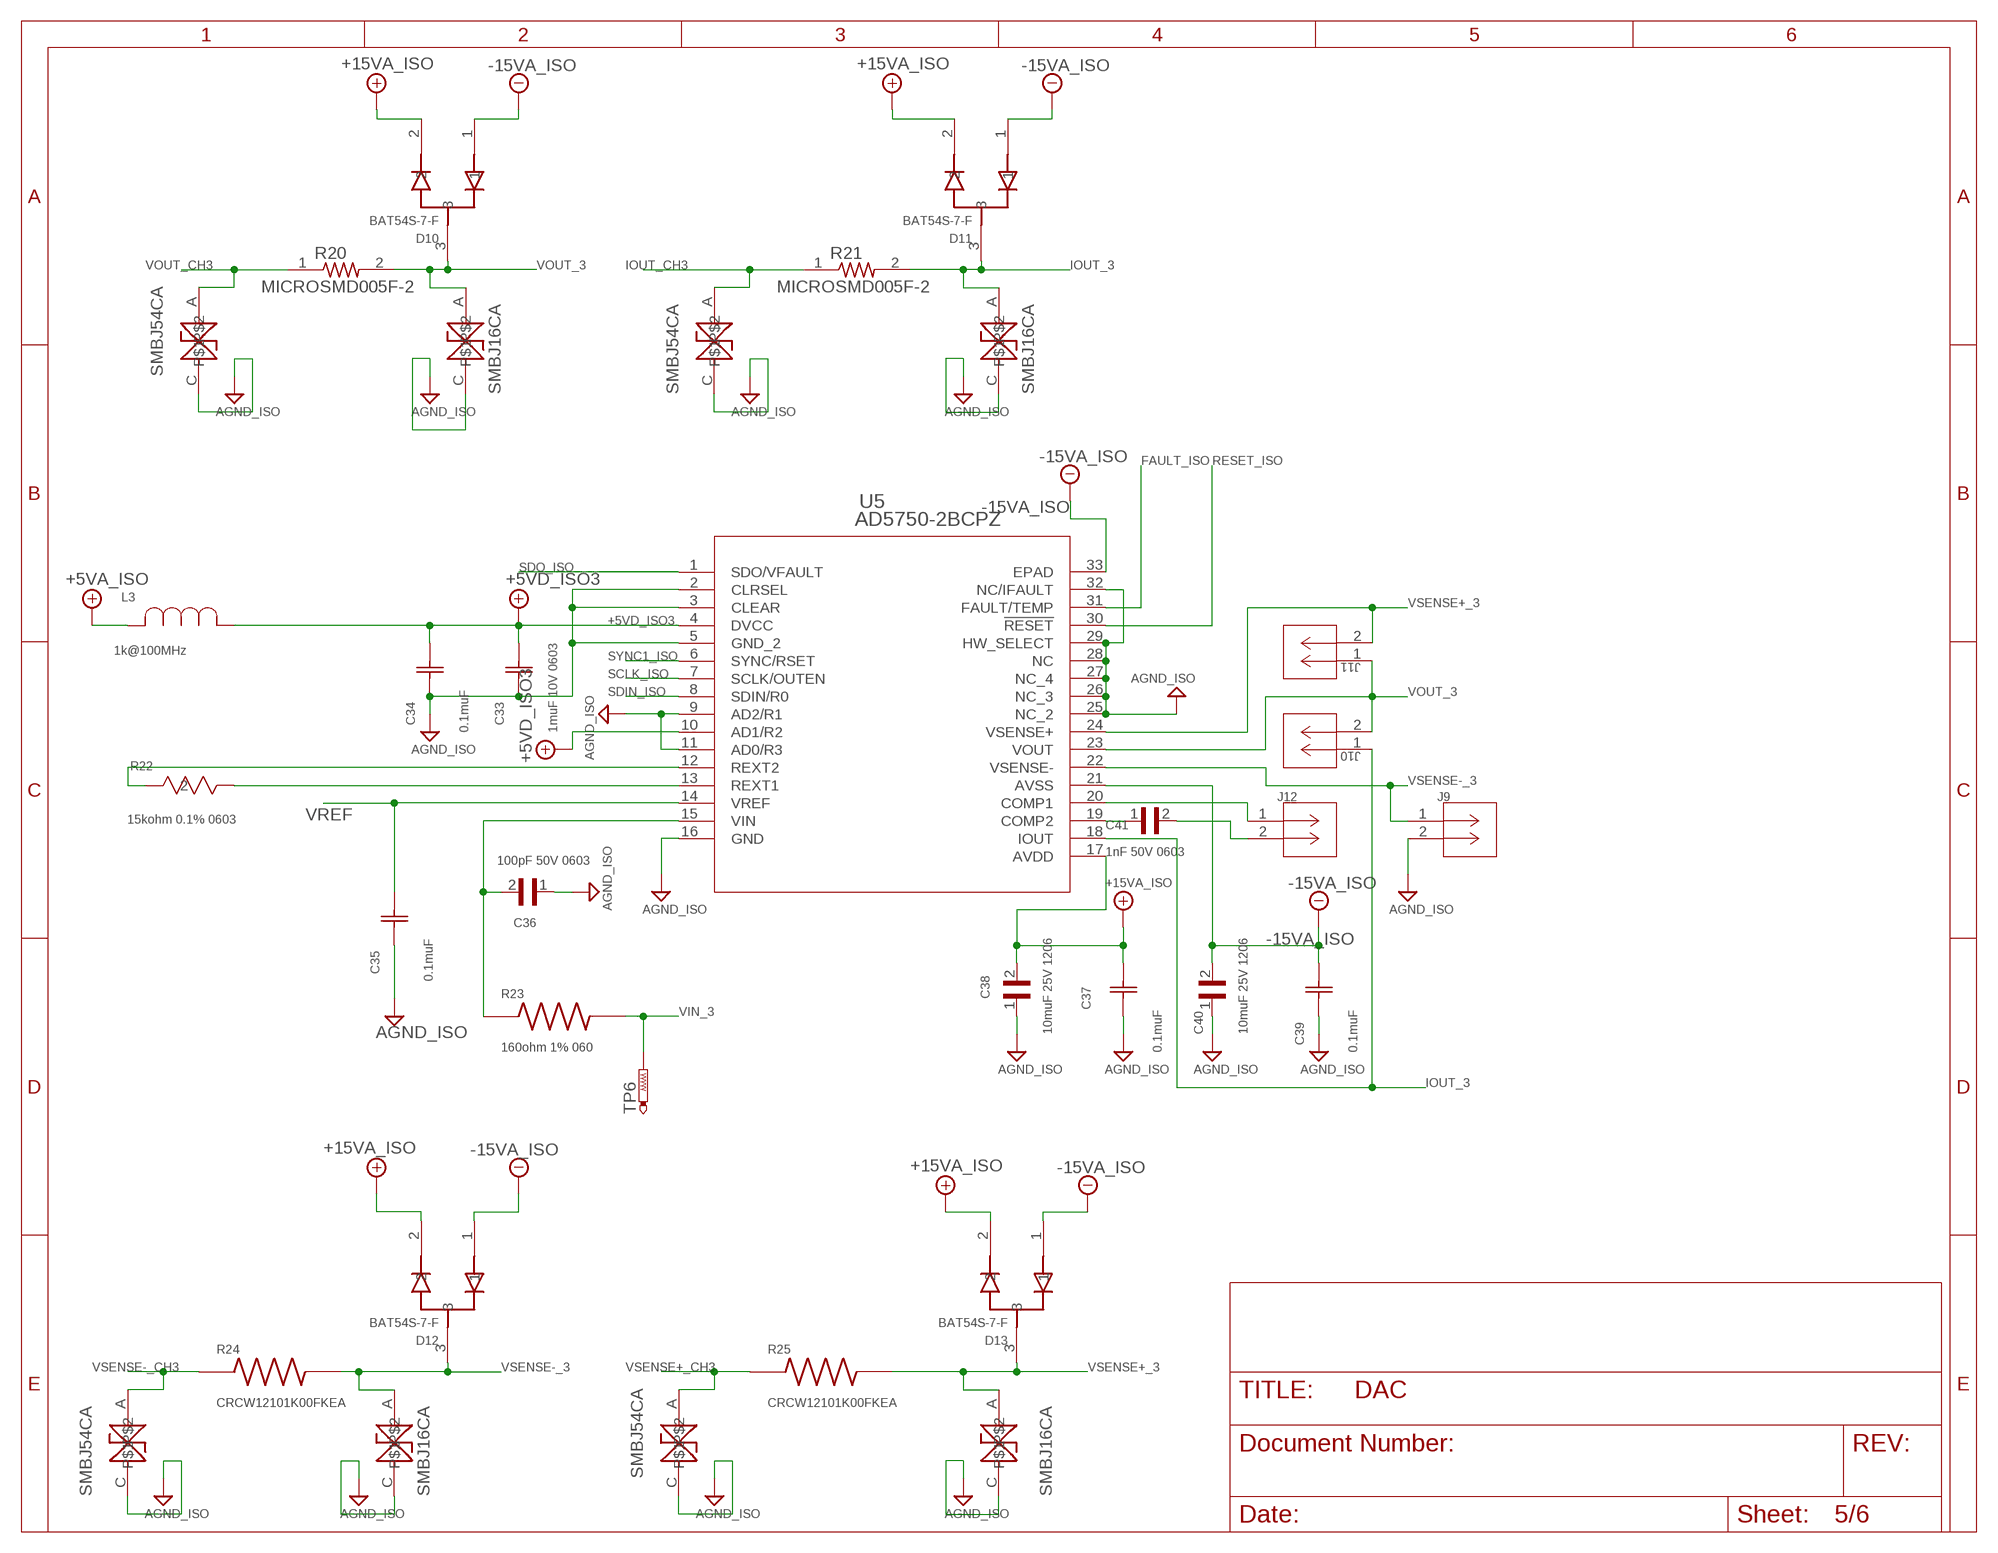
[diagram p4: schematic, sheet 5]

### Parts
C33  1muF 10V 0603  C0603C105K4PALTU  [CAPC17595_90N_KEM]
C34  0.1muF  GRM188R71E104KA01D  [G-188_MUR]
C35  0.1muF  GRM188R71E104KA01D  [G-188_MUR]
C36  100pF 50V 0603  06035A101JAT2A  [CAPC1608X90N]
C37  0.1muF  GRM188R71E104KA01D  [G-188_MUR]
C38  10muF 25V 1206  C1206C106Z3VAC7800  [CAPC3216X180N]
C39  0.1muF  GRM188R71E104KA01D  [G-188_MUR]
C40  10muF 25V 1206  C1206C106Z3VAC7800  [CAPC3216X180N]
C41  1nF 50V 0603  GRM1885C1H102JA01D  [CAPC1608X90N]
D10  BAT54S-7-F  [SOT95P240X110-3N]
D11  BAT54S-7-F  [SOT95P240X110-3N]
D12  BAT54S-7-F  [SOT95P240X110-3N]
D13  BAT54S-7-F  [SOT95P240X110-3N]
J9  61300211121  [CONN_61300211121_WRE]
J10  61300211121  [CONN_61300211121_WRE]
J11  61300211121  [CONN_61300211121_WRE]
J12  61300211121  [CONN_61300211121_WRE]
L3  1k@100MHz  BLM18AG601SN1D  [IND_BLM18_0603_MUR]
R20  MICROSMD005F-2  [RESC3125X65N]
R21  MICROSMD005F-2  [RESC3125X65N]
R22  15kohm 0.1% 0603  ERA-3AEB153V  [RC0603N_PAN]
R23  160ohm 1% 060  ERJ-3GEYJ102V  [RESC1608X55N]
R24  CRCW12101K00FKEA  [RESC3225X60N]
R25  CRCW12101K00FKEA  [RESC3225X60N]
TP6  PTR1B1,27  [B1,27]
TV13  54_SMBJ54CA  [DIOM5436X220N]
TV14  54_SMBJ54CA  [DIOM5436X220N]
TV15  54_SMBJ54CA  [DIOM5436X220N]
TV16  54_SMBJ54CA  [DIOM5436X220N]
TV29  SMBJ16CA  [DIOM5436X220N]
TV30  SMBJ16CA  [DIOM5436X220N]
TV31  SMBJ16CA  [DIOM5436X220N]
TV32  SMBJ16CA  [DIOM5436X220N]
U5  AD5750-2BCPZ  [CP_32_7_ADI]

### Nets
+5VA_ISO: L3.2 ; also sheet 1,2,3,4
+5VD_ISO3: C33.2 C34.2 L3.1 U5.4(DVCC) U5.10(AD1/R2)
+15VA_ISO: C37.2 C38.2 D10.2 D11.2 D12.2 D13.2 U5.17(AVDD) ; also sheet 2,3,4
-15VA_ISO: C39.2 C40.2 D10.1 D11.1 D12.1 D13.1 U5.21(AVSS) U5.33(EPAD) ; also sheet 2,3,4
AGND_ISO: C33.1 C34.1 C35.1 C36.1 C37.1 C38.1 C39.1 C40.1 J9.2 TV13.C TV14.C TV15.C TV16.C TV29.C TV30.C TV31.C TV32.C U5.2(CLRSEL) U5.3(CLEAR) U5.5(GND_2) U5.9(AD2/R1) U5.11(AD0/R3) U5.16(GND) U5.25(NC_2) U5.26(NC_3) U5.27(NC_4) U5.28(NC) U5.29(HW_SELECT) U5.32(NC/IFAULT) ; also sheet 1,2,3,4
FAULT_ISO: U5.31(FAULT/TEMP) ; also sheet 1,2,3,4
IOUT_3: D11.3 J10.1 R21.2 TV30.A U5.18(IOUT)
IOUT_CH3: R21.1 TV14.A ; also sheet 1
N$20: R22.2 U5.12(REXT2)
N$21: R22.1 U5.13(REXT1)
N$23: C36.2 R23.1 U5.15(VIN)
N$24: C41.1 U5.19(COMP2)
N$25: J12.1 U5.20(COMP1)
N$26: C41.2 J12.2
RESET_ISO: U5.30(!RESET) ; also sheet 1,2,3,4
SCLK_ISO: U5.7(SCLK/OUTEN) ; also sheet 1,2,3,4
SDIN_ISO: U5.8(SDIN/R0) ; also sheet 1,2,3,4
SDO_ISO: U5.1(SDO/VFAULT) ; also sheet 1,2,3,4
SYNC1_ISO: U5.6(SYNC/RSET) ; also sheet 1,2,3,4
VIN_3: R23.2 TP6.TP ; also sheet 1
VOUT_3: D10.3 J10.2 J11.1 R20.2 TV29.A U5.23(VOUT)
VOUT_CH3: R20.1 TV13.A ; also sheet 1
VREF: C35.2 U5.14(VREF) ; also sheet 1,2,3,4
VSENSE+_3: D13.3 J11.2 R25.2 TV32.A U5.24(VSENSE+)
VSENSE+_CH3: R25.1 TV16.A
VSENSE-_3: D12.3 J9.1 R24.2 TV31.A U5.22(VSENSE-)
VSENSE-_CH3: R24.1 TV15.A

### Notes on the sheet
- SMBJ54CA
- SMBJ16CA | SMBJ54CA | SMBJ16CA
- SMBJ54CA
- SMBJ54CA | SMBJ16CA | SMBJ16CA

## Sheet 6 of 6

## Library data of the parts
C1 C3 C33 C42 = 1uF-10V-0603:C0603C105K4PALTU; BUILT_BY: EMA_Frank; MANUFACTURER_PART_NUMBER: C0603C105K4PALTU; SOURCELIBRARY: Kemet_2020-03-25_2a; SOURCE_LIBRARY: Kemet_2020-03-25_2.xlr; VENDOR: Kemet
C2 C4-C6 C9 C11 C13 C14 C19 C21 C23 C26 C28 C30 C34 C35 C37 C39 C43 C44 C46 C48 C51-C53 C56-C58 = 1.1uF-50V-0603:GRM188R71E104KA01D; COPYRIGHT: Copyright (C) 2015 Accelerated Designs. All rights reserved; MANUFACTURER_PART_NUMBER: GRM188R71E104KA01D; SOURCELIBRARY: Murata_2014-12-31; VENDOR: Murata
C7 C8 C15-C18 = 100pf_0603_capacitors:06035A101JAT2A: Capacitor: ceramic; MLCC; 100pF; 50V; C0G; ±5%; SMD; 0603; DESCRIPTION: 100pF ±5% 50V Ceramic Capacitor C0G, NP0 0603 (1608 Metric); DIGI-KEY_PART_NUMBER: 478-1175-1-ND; MF: AVX; MP: 06035A101JAT2A; PACKAGE: 1608 AVX; PURCHASE-URL: https://pricing.snapeda.com/search/part/06035A101JAT2A/?ref=eda
C10 C12 = 0805_10uf_capacitors:GRM21BR61A106KE14L: CAP 10UF 10VDC X5R 10% SMD 0805 EMBOSSED TAPE; DESCRIPTION: SMD Capacitor X5R(EIA) with Capacitance: 10uF Tol. 10%. Rated Voltage: 10Vdc; DIGI-KEY_PART_NUMBER: GRM21BR61A106KE14L-ND; MF: Murata Electronics; MP: GRM21BR61A106KE14L; PACKAGE: 0805 Murata
C20 C27 C36 C45 = 100pfcapacitor:06035A101JAT2A: Capacitor: ceramic; MLCC; 100pF; 50V; C0G; ±5%; SMD; 0603; DESCRIPTION: 100pF ±5% 50V Ceramic Capacitor C0G, NP0 0603 (1608 Metric); DIGI-KEY_PART_NUMBER: 478-1175-1-ND; MF: AVX; MP: 06035A101JAT2A; PACKAGE: 1608 AVX; PURCHASE-URL: https://pricing.snapeda.com/search/part/06035A101JAT2A/?ref=eda
C22 C24 C29 C31 C38 C40 C47 C49 C54 C55 = 10mufcapacitors:C1206C106Z3VAC7800; DESCRIPTION: 10µF -20%, +80% 25V Ceramic Capacitor Y5V (F) 1206 (3216 Metric); DIGI-KEY_PART_NUMBER: 399-15076-1-ND; MF: KEMET; MP: C1206C106Z3VAC7800; PACKAGE: 3216 KEMET; PURCHASE-URL: https://pricing.snapeda.com/search/part/C1206C106Z3VAC7800/?ref=eda
C25 C32 C41 C50 = 1nfcapacitor:GRM1885C1H102JA01D; DESCRIPTION: SMD Capacitor C0G(EIA) with Capacitance: 1000pF Tol. 5%. Rated Voltage: 50Vdc; DIGI-KEY_PART_NUMBER: 490-1451-1-ND; MF: Murata; MP: GRM1885C1H102JA01D; PACKAGE: 1608 Murata; PURCHASE-URL: https://pricing.snapeda.com/search/part/GRM1885C1H102JA01D/?ref=eda
CR35 CR36 = D17-19:SBR2U30P1-7; BUILT_BY: EMA_Anthony; COPYRIGHT: Copyright (C) 2016 Accelerated Designs. All rights reserved; MANUFACTURER_PART_NUMBER: SBR2U30P1-7; SOURCELIBRARY: Diodes_Inc_2018-12-15; VENDOR: Diodes Inc
D1-D3 D5-D17 = BAT54S-7-F:BAT54S-7-F: BAT54S Series 30 V 600 mA Surface Mount Schottky Barrier Diode - SOT-23; DESCRIPTION: Diode Array 1 Pair Series Connection Schottky 30V 200mA (DC) Surface Mount TO-236-3, SC-59, SOT-23-3; DIGI-KEY_PART_NUMBER: BAT54S-FDICT-ND; MF: Diodes Inc.; MP: BAT54S-7-F; PACKAGE: SOT-23 Diodes Inc.; PURCHASE-URL: https://pricing.snapeda.com/search/part/BAT54S-7-F/?ref=eda
D18 = ORANGE_LED:LTST-C191KFKT: http://octopart.com/ltst-c190krkt-lite-on-549893; DESCRIPTION: Orange 605nm LED Indication - Discrete 2V 0603 (1608 Metric); DIGI-KEY_PART_NUMBER: 160-1445-1-ND; MF: Lite-On Inc.; MP: LTST-C191KFKT; PACKAGE: 0603 Lite-On; PURCHASE-URL: https://pricing.snapeda.com/search/part/LTST-C191KFKT/?ref=eda
FC1-FC3 = New_FilterCapacitor:F1-4
FL1-FL5 = BLM21PG331SN1D:BLM21PG331SN1D: SMD Ferrite 0805 330 Ohm +-25% 6000mA; DESCRIPTION: 330 Ohms @ 100MHz 1 Power Line Ferrite Bead 0805 (2012 Metric) 1.5A 70mOhm; DIGI-KEY_PART_NUMBER: 490-5988-1-ND; MF: Murata; MP: BLM21PG331SN1D; PACKAGE: 2012 Murata; PURCHASE-URL: https://pricing.snapeda.com/search/part/BLM21PG331SN1D/?ref=eda
J1-J16 J29-J32 = 2pinheader:61300211121; BUILT_BY: EMA_Anthony; COPYRIGHT: Copyright (C) 2018 Accelerated Designs. All rights reserved; MANUFACTURER_PART_NUMBER: 61300211121; SOURCELIBRARY: Wurth_Electronics_2019-10-17; VENDOR: Wurth Electronics
J17-J20 = BNC:1-1337543-0: BNC appliance socket, right angle [TE Connectivity] 1-1337543-0 BNC appliance socket, right angle; DESCRIPTION: BNC Connector Jack, Female Socket 50Ohm Panel Mount, Through Hole, Right Angle Solder; MF: TE Connectivity; MP: 113375430; PACKAGE: None
J21-J24 = 5-146274-3:5-146274-3: 03 MODII HDR SRST B/A .100CL Check prices <https://pricing.snapeda.com/parts/5-146274-3/TE%20Connectivity/view-part?ref=eda>; AVAILABILITY: In Stock; CENTERLINE_PITCH: 2.54 mm[.1 in]; COMMENT: 5-146274-3; DESCRIPTION: AMPMODU 3 Position 2.54 mm Single Row Through-Hole Straight Breakaway Header; EU_ROHS_COMPLIANCE: Compliant; MF: TE Connectivity; MP: 5-146274-3; NUMBER_OF_POSITIONS: 3; PACKAGE: None; PRICE: None; PRODUCT_TYPE: Connector
L1-L5 = B2:BLM18AG601SN1D; BUILT_BY: EMA_UL_Team; MANUFACTURER_PART_NUMBER: BLM18AG601SN1D; SOURCELIBRARY: Murata_2010-01-01IND_BLM; VENDOR: MURATA
PS1 PS2 = Polyswitch:POLYSWITCH
Q2 = transistor-power:IRF9530: P-CHANNEL HEXFET POWER-MOS-FET Source: http://www.irf.com/product-info/datasheets/data/irf9530.pdf
R2 R3 R9-R11 = 33ohmresistor:CRCW060333R0FKEA: RESISTOR, 0603, 33R, 1%, FULL REEL; DESCRIPTION: 33 Ohms ±1% 0.1W, 1/10W Chip Resistor 0603 (1608 Metric) Automotive AEC-Q200 Thick Film; DIGI-KEY_PART_NUMBER: 541-33.0HCT-ND; MF: Vishay; MP: CRCW060333R0FKEA; PACKAGE: 1508 Vishay; PURCHASE-URL: https://pricing.snapeda.com/search/part/CRCW060333R0FKEA/?ref=eda
R4 R5 R7 R12 R24 R25 R30 R31 = 1210_1Kohms:CRCW12101K00FKEA: RES, THICK FILM, 1K, 1%, 0.5W, 1210; DESCRIPTION: 1 kOhms ±1% 0.5W, 1/2W Chip Resistor 1210 (3225 Metric) Automotive AEC-Q200 Thick Film; DIGI-KEY_PART_NUMBER: 541-1.00KAACT-ND; MF: Vishay; MP: CRCW12101K00FKEA; PACKAGE: 3225 Vishay; PURCHASE-URL: https://pricing.snapeda.com/search/part/CRCW12101K00FKEA/?ref=eda
R6 R18 R19 R23 R29 = 1k0603resistor:ERJ-3GEYJ102V: Res Thick Film 1.6 x 0.8 mm 1K Ohm 5% 0.1W(1/10W) 200ppm/ C Molded SMD Punched Carrier T/R; DESCRIPTION: 1 kOhms ±5% 0.1W, 1/10W Chip Resistor 0603 (1608 Metric) Automotive AEC-Q200 Thick Film; DIGI-KEY_PART_NUMBER: P1.0KGCT-ND; MF: Panasonic; MP: ERJ-3GEYJ102V; PACKAGE: 1608 Panasonic Electronic Components; PURCHASE-URL: https://pricing.snapeda.com/search/part/ERJ-3GEYJ102V/?ref=eda
R8 R13 R22 R28 R35-R37 R40 = 15kohmresistor:ERA-3AEB153V; BUILT_BY: EMA_UL_Team; MANUFACTURER_PART_NUMBER: ERA-3AEB153V; SOURCELIBRARY: Panasonic_2010-01-01_Res1; VENDOR: Panasonic
R14-R17 R20 R21 R26 R27 = MICROSMD005F-2:MICROSMD005F-2: PTC Resettable Fuse 0.05A(hold) 0.15A(trip) 30VDC 10A 1W 1.5s 3.6Ohm SMD Solder Pad 1210 T/R Automotive; DESCRIPTION: Polymeric PTC Resettable Fuse 30V 50mA Ih Surface Mount 1210 (3225 Metric), Concave; DIGI-KEY_PART_NUMBER: MICROSMD005F-2CT-ND; MF: Littelfuse Inc.; MP: MICROSMD005F-2; PACKAGE: 1210 TE Connectivity; PURCHASE-URL: https://pricing.snapeda.com/search/part/MICROSMD005F-2/?ref=eda
R32-R34 R38 = 0603zeroOhm:CRCW06030000Z0EBC; DESCRIPTION: 0 Ohms Jumper 0.1W, 1/10W Chip Resistor 0603 (1608 Metric) Thick Film; DIGI-KEY_PART_NUMBER: 541-4013-1-ND; MF: Vishay Dale; MP: CRCW06030000Z0EBC; PACKAGE: 1608 Rohm Semiconductor
TP1-TP7 = testpad:PTR1: TEST PIN
TV1-TV16 = SMBJ16CA:54_SMBJ54CA
TV17-TV34 = SMBJ16CA:SMBJ16CA
U1 U2 U5 U6 = AD5750-2BCPZ:AD5750-2BCPZ; BUILT_BY: EMA_Christopher; COPYRIGHT: Copyright (C) 2016 Accelerated Designs. All rights reserved; MANUFACTURER_PART_NUMBER: AD5750-2BCPZ; SOURCELIBRARY: Analog_Devices_2018-07-13; VENDOR: Analog Devices Inc
U3 = ADUM3391BRWZ:ADUM3301BRWZ; BUILT_BY: EMA_UL_Team; COPYRIGHT: Copyright (C) 2018 Accelerated Designs. All rights reserved; MANUFACTURER_PART_NUMBER: ADUM3301BRWZ; SOURCELIBRARY: Analog_2019-03-08; VENDOR: Analog Devices Inc
U4 = ADUM5400ARWZ:ADUM5400ARWZ; BUILT_BY: EMA_UL_Team; MANUFACTURER_PART_NUMBER: ADUM5400ARWZ; SOURCELIBRARY: Analog_2012-01-01_8; VENDOR: Analog Devices Inc
U7 = AD5658RARUZ:AD5686RARUZ; BUILT_BY: SunStream; COPYRIGHT: Copyright (C) 2018 Accelerated Designs. All rights reserved; MANUFACTURER_PART_NUMBER: AD5686RARUZ; SOURCELIBRARY: Analog_Devices_Inc_2020-09-15; VENDOR: Analog Devices Inc
U9 = zd:CZRF15VB-HF; BUILT_BY: EMA_UL_Team; MANUFACTURER_PART_NUMBER: CZRF15VB-HF; SOURCELIBRARY: ComchipTechnology_2015-04-20; VENDOR: Comchip
U10 = MAX6071BAUT25T:MAX6071BAUT25T: Check availability <https://pricing.snapeda.com/parts/MAX6071BAUT25%2BT/Maxim%20Integrated/view-part?ref=eda>; AVAILABILITY: In Stock; DESCRIPTION: Series Voltage Reference IC Fixed 2.5V V ±0.08% 10 mA SOT-6; MF: Maxim Integrated; MP: MAX6071BAUT25+T; PACKAGE: SOT-23-6 Maxim Integrated; PRICE: None; PURCHASE-URL: https://pricing.snapeda.com/search/part/MAX6071BAUT25+T/?ref=eda
X1 X2 = con-samtec:TSW-110-*-G: THROUGH-HOLE .025" SQ POST HEADER Source: Samtec TSW.pdf; MF: Samtec Inc.; MPN: TSW-110-07-G-D